# EAGLE design iso60 (EAGLE 9.6.2)
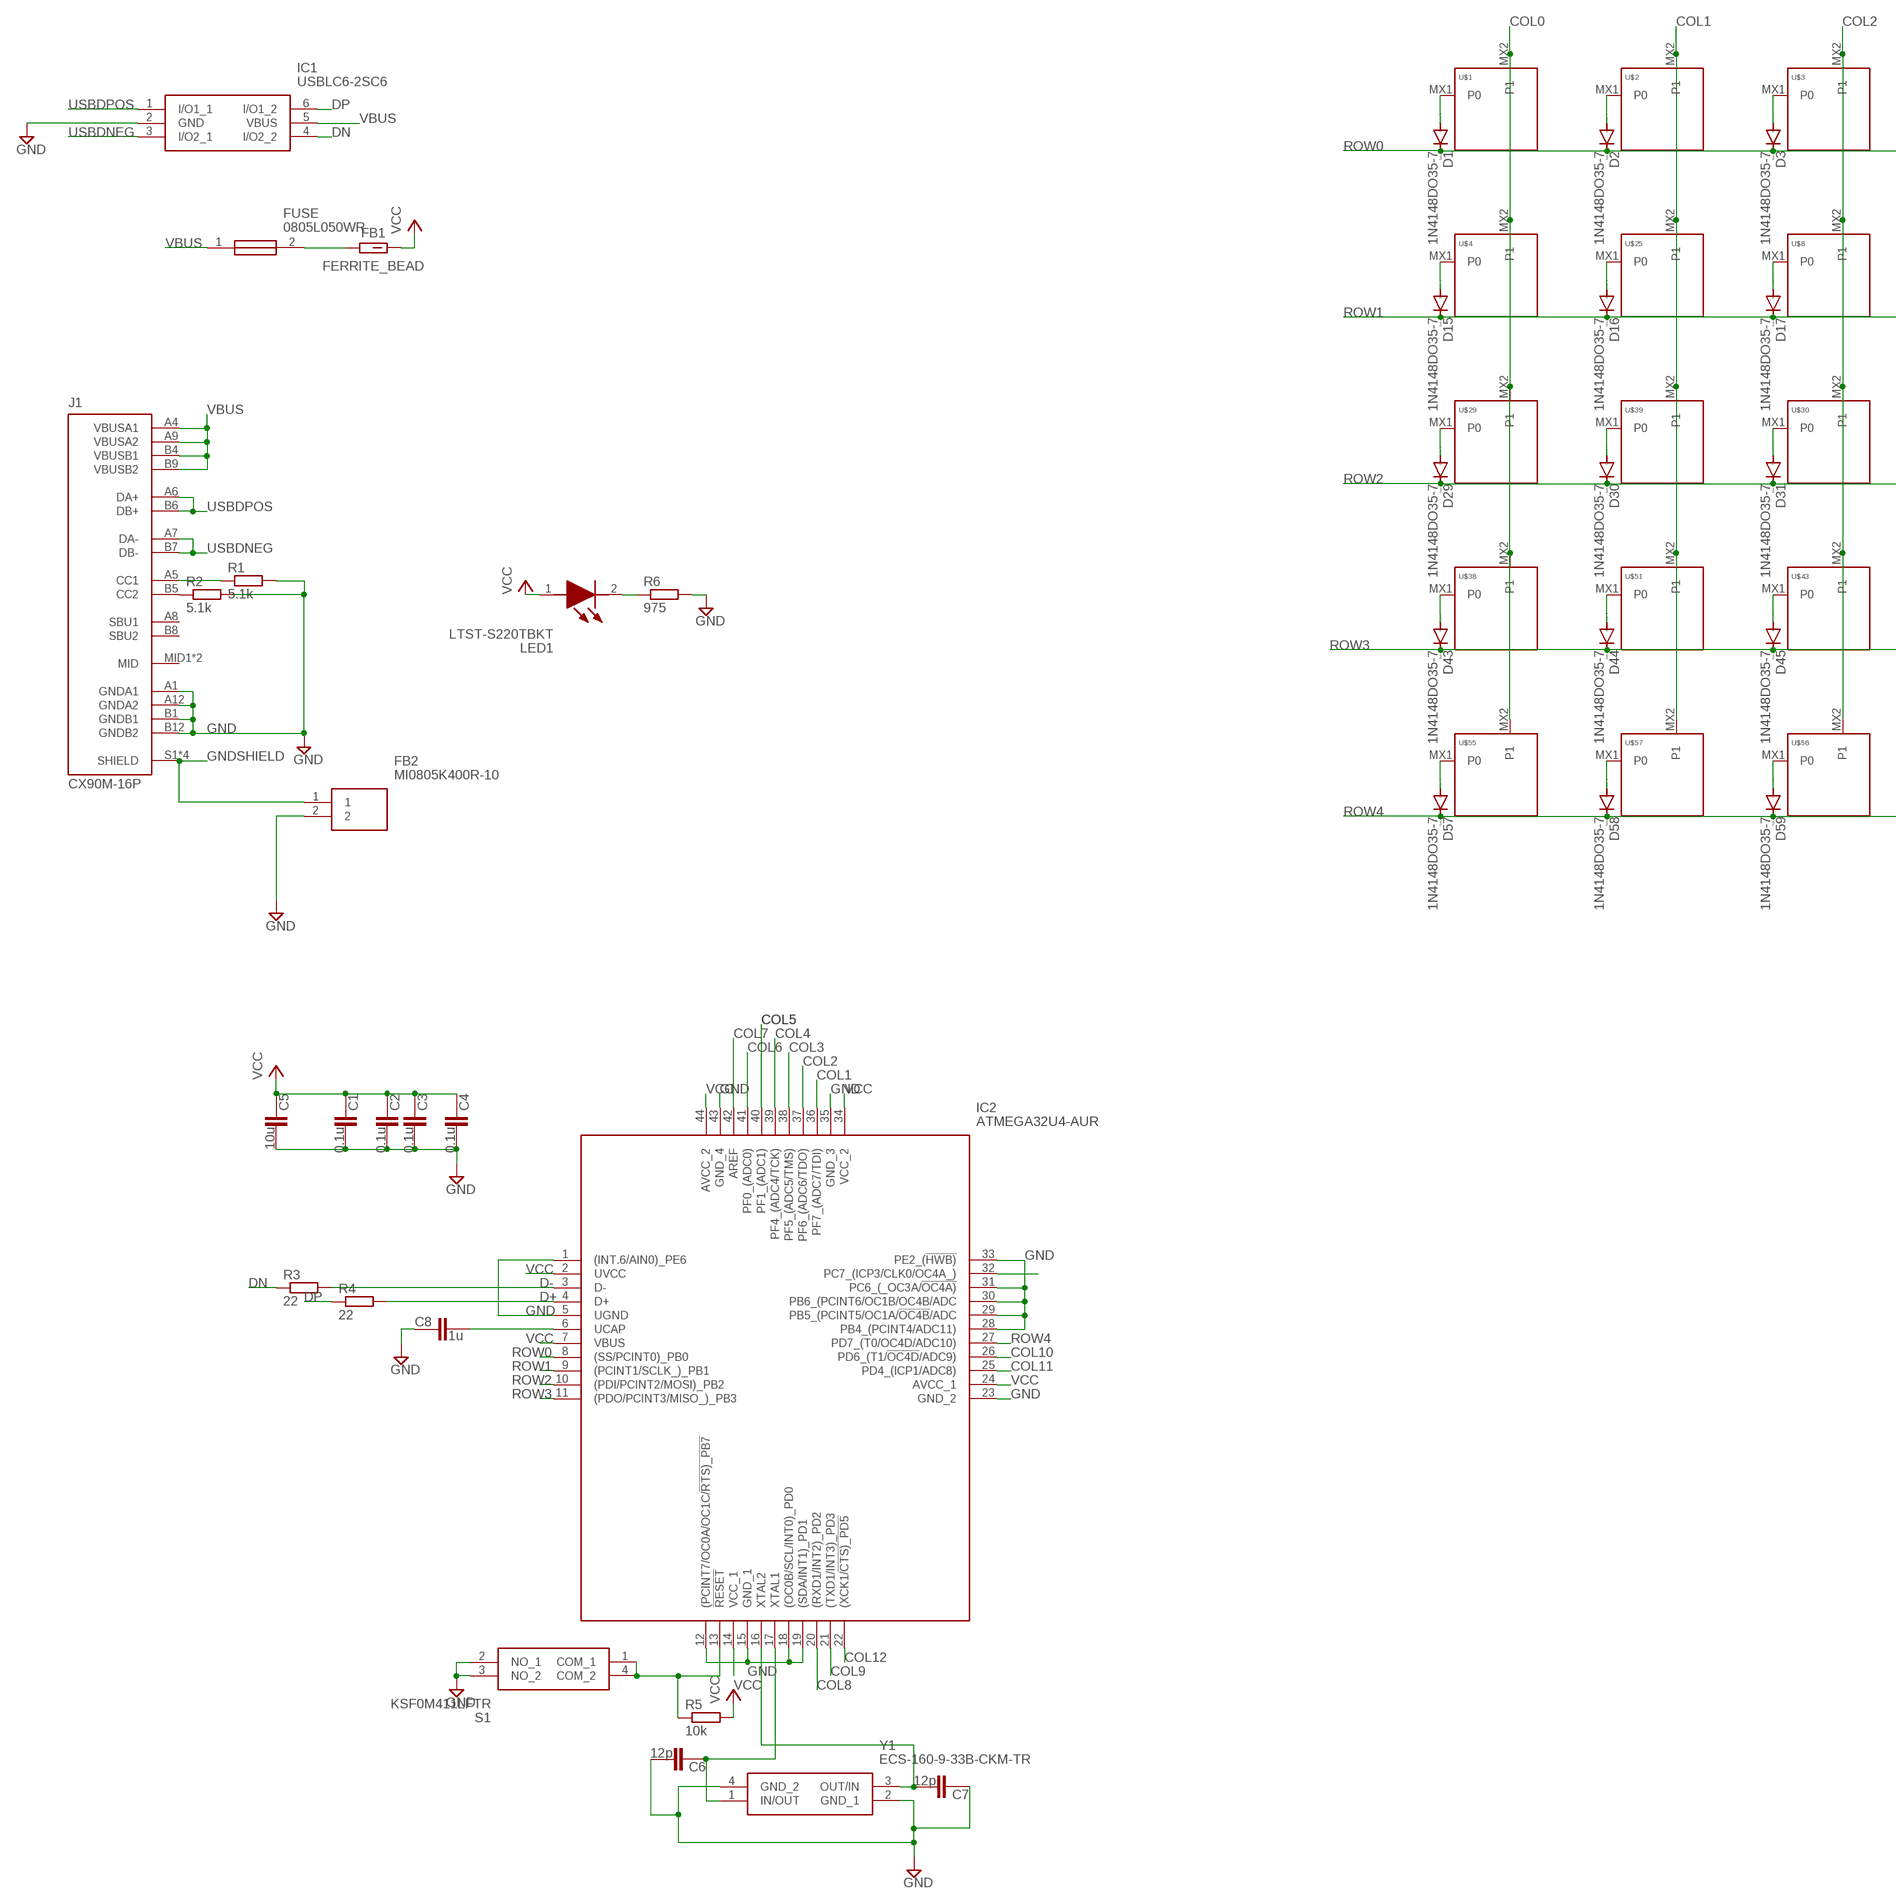
[diagram p0: schematic, sheet 1, part 1 of 2]
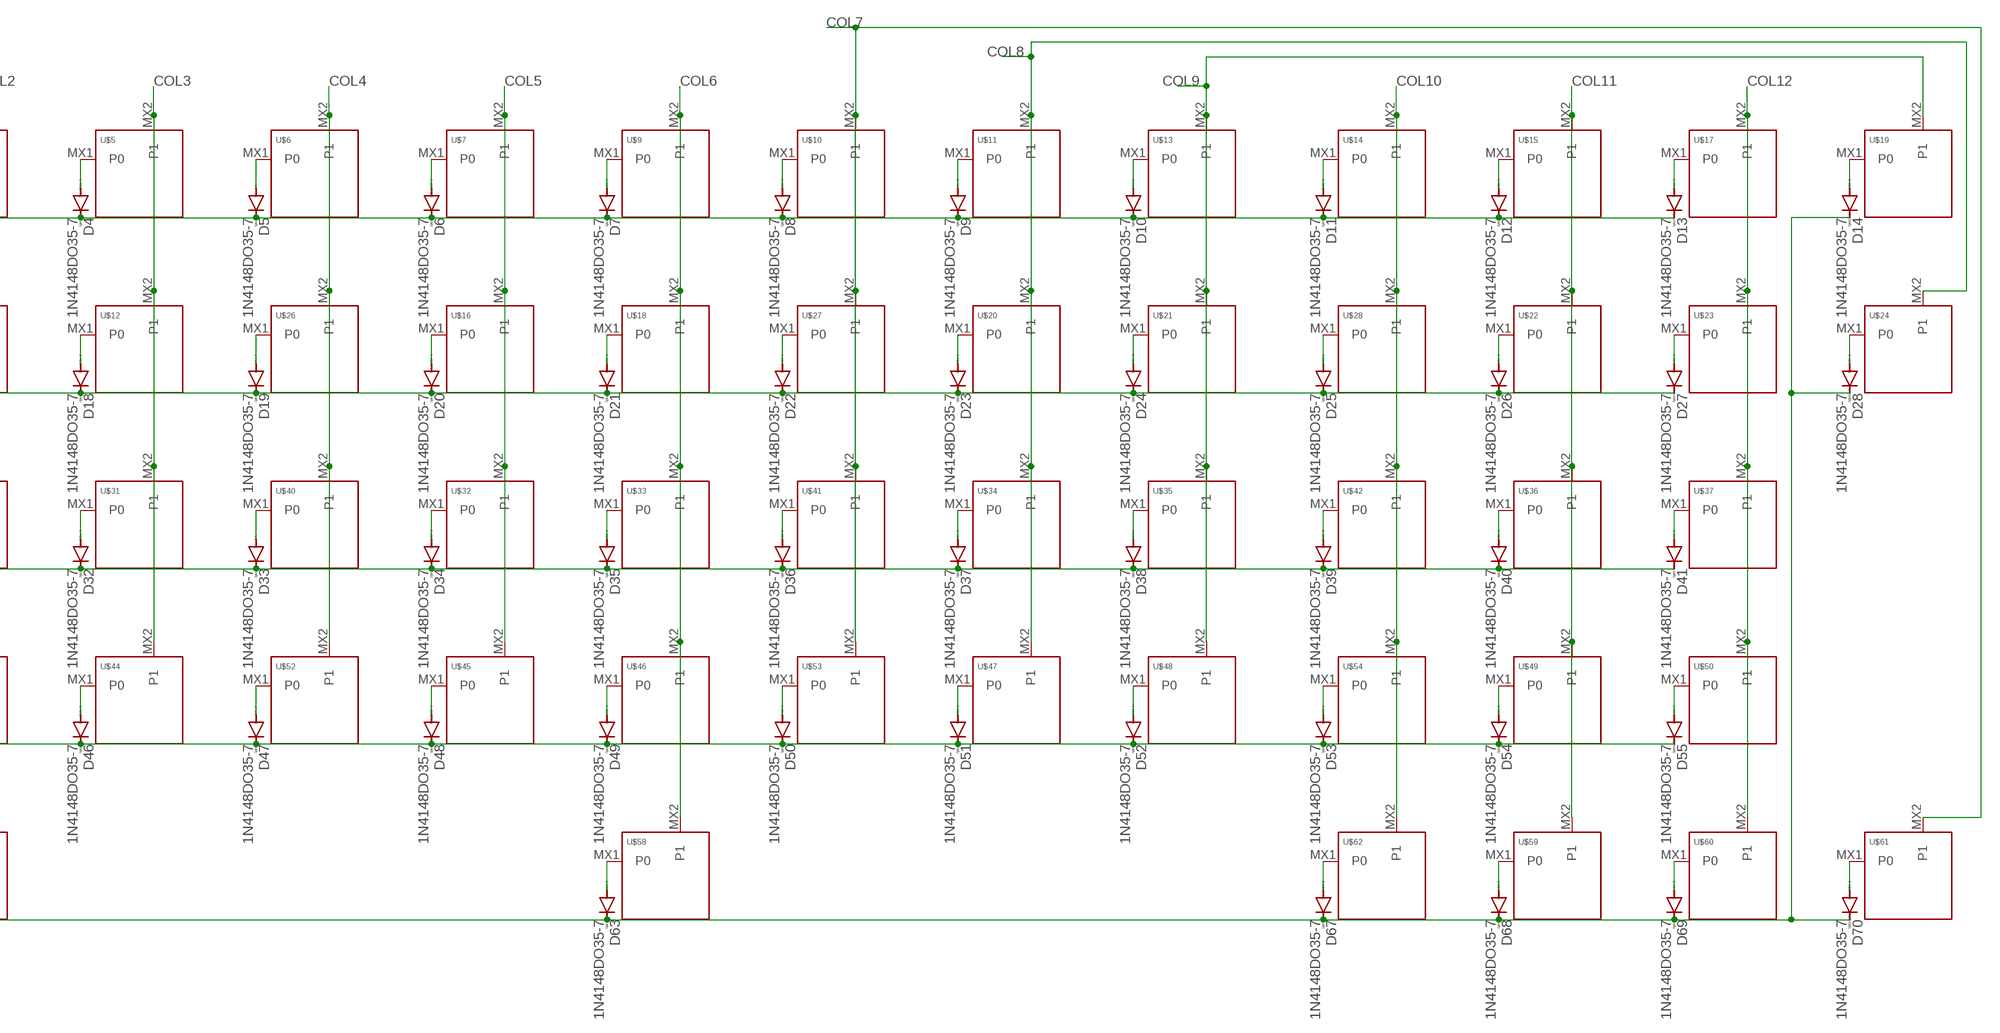
[diagram p1: schematic, sheet 1, part 2 of 2]

## Parts
C1  0.1u  CAPACITOR-C0805  [C0805]
C2  0.1u  CAPACITOR-C0805  [C0805]
C3  0.1u  CAPACITOR-C0805  [C0805]
C4  0.1u  CAPACITOR-C0805  [C0805]
C5  10u  CAPACITOR-C0805  [C0805]
C6  12p  CAPACITOR-C0805  [C0805]
C7  12p  CAPACITOR-C0805  [C0805]
C8  1u  CAPACITOR-C0805  [C0805]
D1  1N4148DO35-7  [DO35-7]
D2  1N4148DO35-7  [DO35-7]
D3  1N4148DO35-7  [DO35-7]
D4  1N4148DO35-7  [DO35-7]
D5  1N4148DO35-7  [DO35-7]
D6  1N4148DO35-7  [DO35-7]
D7  1N4148DO35-7  [DO35-7]
D8  1N4148DO35-7  [DO35-7]
D9  1N4148DO35-7  [DO35-7]
D10  1N4148DO35-7  [DO35-7]
D11  1N4148DO35-7  [DO35-7]
D12  1N4148DO35-7  [DO35-7]
D13  1N4148DO35-7  [DO35-7]
D14  1N4148DO35-7  [DO35-7]
D15  1N4148DO35-7  [DO35-7]
D16  1N4148DO35-7  [DO35-7]
D17  1N4148DO35-7  [DO35-7]
D18  1N4148DO35-7  [DO35-7]
D19  1N4148DO35-7  [DO35-7]
D20  1N4148DO35-7  [DO35-7]
D21  1N4148DO35-7  [DO35-7]
D22  1N4148DO35-7  [DO35-7]
D23  1N4148DO35-7  [DO35-7]
D24  1N4148DO35-7  [DO35-7]
D25  1N4148DO35-7  [DO35-7]
D26  1N4148DO35-7  [DO35-7]
D27  1N4148DO35-7  [DO35-7]
D28  1N4148DO35-7  [DO35-7]
D29  1N4148DO35-7  [DO35-7]
D30  1N4148DO35-7  [DO35-7]
D31  1N4148DO35-7  [DO35-7]
D32  1N4148DO35-7  [DO35-7]
D33  1N4148DO35-7  [DO35-7]
D34  1N4148DO35-7  [DO35-7]
D35  1N4148DO35-7  [DO35-7]
D36  1N4148DO35-7  [DO35-7]
D37  1N4148DO35-7  [DO35-7]
D38  1N4148DO35-7  [DO35-7]
D39  1N4148DO35-7  [DO35-7]
D40  1N4148DO35-7  [DO35-7]
D41  1N4148DO35-7  [DO35-7]
D43  1N4148DO35-7  [DO35-7]
D44  1N4148DO35-7  [DO35-7]
D45  1N4148DO35-7  [DO35-7]
D46  1N4148DO35-7  [DO35-7]
D47  1N4148DO35-7  [DO35-7]
D48  1N4148DO35-7  [DO35-7]
D49  1N4148DO35-7  [DO35-7]
D50  1N4148DO35-7  [DO35-7]
D51  1N4148DO35-7  [DO35-7]
D52  1N4148DO35-7  [DO35-7]
D53  1N4148DO35-7  [DO35-7]
D54  1N4148DO35-7  [DO35-7]
D55  1N4148DO35-7  [DO35-7]
D57  1N4148DO35-7  [DO35-7]
D58  1N4148DO35-7  [DO35-7]
D59  1N4148DO35-7  [DO35-7]
D63  1N4148DO35-7  [DO35-7]
D67  1N4148DO35-7  [DO35-7]
D68  1N4148DO35-7  [DO35-7]
D69  1N4148DO35-7  [DO35-7]
D70  1N4148DO35-7  [DO35-7]
FB1  FERRITE_BEAD  FBCHIP-0805(2012-METRIC)  [BEADC2012X105N]
FB2  MI0805K400R-10  [BEADC2012X110N]
FUSE  0805L050WR  [FUSC2114X125N]
IC1  USBLC6-2SC6  [SOT95P280X145-6N]
IC2  ATMEGA32U4-AUR  [QFP80P1200X1200X120-44N]
J1  CX90M-16P  [HRS_CX90M-16P]
LED1  LTST-S220TBKT  [LTSTS220TBKT]
R1  5.1k  RESISTOR-0805  [R0805]
R2  5.1k  RESISTOR-0805  [R0805]
R3  22  RESISTOR-0805  [R0805]
R4  22  RESISTOR-0805  [R0805]
R5  10k  RESISTOR-0805  [R0805]
R6  975  RESISTOR-0805  [R0805]
S1  KSF0M411LFTR  [KSF0M411LFTR]
U$1  KEYSWITCH-PLAIN-MXHS-1U  [MXHS-1U]
U$2  KEYSWITCH-PLAIN-MXHS-1U  [MXHS-1U]
U$3  KEYSWITCH-PLAIN-MXHS-1U  [MXHS-1U]
U$4  KEYSWITCH-PLAIN-MXHS-1U  [MXHS-1U]
U$5  KEYSWITCH-PLAIN-MXHS-1U  [MXHS-1U]
U$6  KEYSWITCH-PLAIN-MXHS-1U  [MXHS-1U]
U$7  KEYSWITCH-PLAIN-MXHS-1U  [MXHS-1U]
U$8  KEYSWITCH-PLAIN-MXHS-1U  [MXHS-1U]
U$9  KEYSWITCH-PLAIN-MXHS-1U  [MXHS-1U]
U$10  KEYSWITCH-PLAIN-MXHS-1U  [MXHS-1U]
U$11  KEYSWITCH-PLAIN-MXHS-1U  [MXHS-1U]
U$12  KEYSWITCH-PLAIN-MXHS-1U  [MXHS-1U]
U$13  KEYSWITCH-PLAIN-MXHS-1U  [MXHS-1U]
U$14  KEYSWITCH-PLAIN-MXHS-1U  [MXHS-1U]
U$15  KEYSWITCH-PLAIN-MXHS-1U  [MXHS-1U]
U$16  KEYSWITCH-PLAIN-MXHS-1U  [MXHS-1U]
U$17  KEYSWITCH-PLAIN-MXHS-1U  [MXHS-1U]
U$18  KEYSWITCH-PLAIN-MXHS-1U  [MXHS-1U]
U$19  KEYSWITCH-PLAIN-MXHS-1U  [MXHS-1U]
U$20  KEYSWITCH-PLAIN-MXHS-1U  [MXHS-1U]
U$21  KEYSWITCH-PLAIN-MXHS-1U  [MXHS-1U]
U$22  KEYSWITCH-PLAIN-MXHS-1U  [MXHS-1U]
U$23  KEYSWITCH-PLAIN-MXHS-1U  [MXHS-1U]
U$24  KEYSWITCH-PLAIN-MXHS-1U  [MXHS-1U]
U$25  KEYSWITCH-PLAIN-MXHS-1U  [MXHS-1U]
U$26  KEYSWITCH-PLAIN-MXHS-1U  [MXHS-1U]
U$27  KEYSWITCH-PLAIN-MXHS-1U  [MXHS-1U]
U$28  KEYSWITCH-PLAIN-MXHS-1U  [MXHS-1U]
U$29  KEYSWITCH-PLAIN-MXHS-1U  [MXHS-1U]
U$30  KEYSWITCH-PLAIN-MXHS-1U  [MXHS-1U]
U$31  KEYSWITCH-PLAIN-MXHS-1U  [MXHS-1U]
U$32  KEYSWITCH-PLAIN-MXHS-1U  [MXHS-1U]
U$33  KEYSWITCH-PLAIN-MXHS-1U  [MXHS-1U]
U$34  KEYSWITCH-PLAIN-MXHS-1U  [MXHS-1U]
U$35  KEYSWITCH-PLAIN-MXHS-1U  [MXHS-1U]
U$36  KEYSWITCH-PLAIN-MXHS-1U  [MXHS-1U]
U$37  KEYSWITCH-PLAIN-MXHS-1U  [MXHS-1U]
U$38  KEYSWITCH-PLAIN-MXHS-1U  [MXHS-1U]
U$39  KEYSWITCH-PLAIN-MXHS-1U  [MXHS-1U]
U$40  KEYSWITCH-PLAIN-MXHS-1U  [MXHS-1U]
U$41  KEYSWITCH-PLAIN-MXHS-1U  [MXHS-1U]
U$42  KEYSWITCH-PLAIN-MXHS-1U  [MXHS-1U]
U$43  KEYSWITCH-PLAIN-MXHS-1U  [MXHS-1U]
U$44  KEYSWITCH-PLAIN-MXHS-1U  [MXHS-1U]
U$45  KEYSWITCH-PLAIN-MXHS-1U  [MXHS-1U]
U$46  KEYSWITCH-PLAIN-MXHS-1U  [MXHS-1U]
U$47  KEYSWITCH-PLAIN-MXHS-1U  [MXHS-1U]
U$48  KEYSWITCH-PLAIN-MXHS-1U  [MXHS-1U]
U$49  KEYSWITCH-PLAIN-MXHS-1U  [MXHS-1U]
U$50  KEYSWITCH-PLAIN-MXHS-1U  [MXHS-1U]
U$51  KEYSWITCH-PLAIN-MXHS-1U  [MXHS-1U]
U$52  KEYSWITCH-PLAIN-MXHS-1U  [MXHS-1U]
U$53  KEYSWITCH-PLAIN-MXHS-1U  [MXHS-1U]
U$54  KEYSWITCH-PLAIN-MXHS-1U  [MXHS-1U]
U$55  KEYSWITCH-PLAIN-MXHS-1U  [MXHS-1U]
U$56  KEYSWITCH-PLAIN-MXHS-1U  [MXHS-1U]
U$57  KEYSWITCH-PLAIN-MXHS-1U  [MXHS-1U]
U$58  KEYSWITCH-PLAIN-MXHS-1U  [MXHS-1U]
U$59  KEYSWITCH-PLAIN-MXHS-1U  [MXHS-1U]
U$60  KEYSWITCH-PLAIN-MXHS-1U  [MXHS-1U]
U$61  KEYSWITCH-PLAIN-MXHS-1U  [MXHS-1U]
U$62  KEYSWITCH-PLAIN-MXHS-1U  [MXHS-1U]
Y1  ECS-160-9-33B-CKM-TR  [ECS2501033BCKMTR]

## Nets
COL0: IC2.32(PC7_(ICP3/CLK0/OC4A_)) U$1.MX2(P1) U$4.MX2(P1) U$29.MX2(P1) U$38.MX2(P1) U$55.MX2(P1)
COL1: IC2.36(PF7_(ADC7/TDI)) U$2.MX2(P1) U$25.MX2(P1) U$39.MX2(P1) U$51.MX2(P1) U$57.MX2(P1)
COL2: IC2.37(PF6_(ADC6/TDO)) U$3.MX2(P1) U$8.MX2(P1) U$30.MX2(P1) U$43.MX2(P1) U$56.MX2(P1)
COL3: IC2.38(PF5_(ADC5/TMS)) U$5.MX2(P1) U$12.MX2(P1) U$31.MX2(P1) U$44.MX2(P1)
COL4: IC2.39(PF4_(ADC4/TCK)) U$6.MX2(P1) U$26.MX2(P1) U$40.MX2(P1) U$52.MX2(P1)
COL5: IC2.40(PF1_(ADC1)) U$7.MX2(P1) U$16.MX2(P1) U$32.MX2(P1) U$45.MX2(P1)
COL6: IC2.41(PF0_(ADC0)) U$9.MX2(P1) U$18.MX2(P1) U$33.MX2(P1) U$46.MX2(P1) U$58.MX2(P1)
COL7: IC2.42(AREF) U$10.MX2(P1) U$27.MX2(P1) U$41.MX2(P1) U$53.MX2(P1) U$61.MX2(P1)
COL8: IC2.20((RXD1/INT2)_PD2) U$11.MX2(P1) U$20.MX2(P1) U$24.MX2(P1) U$34.MX2(P1) U$47.MX2(P1)
COL9: IC2.21((TXD1/INT3)_PD3) U$13.MX2(P1) U$19.MX2(P1) U$21.MX2(P1) U$35.MX2(P1) U$48.MX2(P1)
COL10: IC2.26(PD6_(T1/!OC4D!/ADC9)) U$14.MX2(P1) U$28.MX2(P1) U$42.MX2(P1) U$54.MX2(P1) U$62.MX2(P1)
COL11: IC2.25(PD4_(ICP1/ADC8)) U$15.MX2(P1) U$22.MX2(P1) U$36.MX2(P1) U$49.MX2(P1) U$59.MX2(P1)
COL12: IC2.22((XCK1/!CTS)_PD5) U$17.MX2(P1) U$23.MX2(P1) U$37.MX2(P1) U$50.MX2(P1) U$60.MX2(P1)
D+: IC2.4(D+) R4.2
D-: IC2.3(D-) R3.2
DN: IC1.4(I/O2_2) R3.1
DP: IC1.6(I/O1_2) R4.1
GND: C1.2 C2.2 C3.2 C4.2 C5.2 C6.2 C7.1 C8.1 FB2.2 IC1.2(GND) IC2.1((INT.6/AIN0)_PE6) IC2.5(UGND) IC2.12((PCINT7/OC0A/OC1C/!RTS)_PB7) IC2.15(GND_1) IC2.18((OC0B/SCL/INT0)_PD0) IC2.19((SDA/INT1)_PD1) IC2.23(GND_2) IC2.28(PB4_(PCINT4/ADC11)) IC2.29(PB5_(PCINT5/OC1A/!OC4B!/ADC) IC2.30(PB6_(PCINT6/OC1B/OC4B/ADC) IC2.31(PC6_(_OC3A/!OC4A)) IC2.33(PE2_(!HWB)) IC2.35(GND_3) IC2.43(GND_4) J1.A1(GNDA1) J1.A12(GNDA2) J1.B1(GNDB1) J1.B12(GNDB2) R1.2 R2.2 R6.2 S1.2(NO_1) S1.3(NO_2) Y1.2(GND_1) Y1.4(GND_2)
GNDSHIELD: FB2.1 J1.S1(SHIELD) J1.S2(SHIELD) J1.S3(SHIELD) J1.S4(SHIELD)
N$1: D1.A U$1.MX1(P0)
N$2: D2.A U$2.MX1(P0)
N$3: D3.A U$3.MX1(P0)
N$4: D4.A U$5.MX1(P0)
N$5: D5.A U$6.MX1(P0)
N$6: D6.A U$7.MX1(P0)
N$7: D7.A U$9.MX1(P0)
N$8: D8.A U$10.MX1(P0)
N$9: D9.A U$11.MX1(P0)
N$10: D10.A U$13.MX1(P0)
N$11: D11.A U$14.MX1(P0)
N$12: D12.A U$15.MX1(P0)
N$13: D13.A U$17.MX1(P0)
N$14: D14.A U$19.MX1(P0)
N$15: D15.A U$4.MX1(P0)
N$16: D16.A U$25.MX1(P0)
N$17: D17.A U$8.MX1(P0)
N$18: D18.A U$12.MX1(P0)
N$19: D19.A U$26.MX1(P0)
N$20: D20.A U$16.MX1(P0)
N$21: D21.A U$18.MX1(P0)
N$22: D22.A U$27.MX1(P0)
N$23: D23.A U$20.MX1(P0)
N$24: D24.A U$21.MX1(P0)
N$25: D25.A U$28.MX1(P0)
N$26: D26.A U$22.MX1(P0)
N$27: D27.A U$23.MX1(P0)
N$28: D28.A U$24.MX1(P0)
N$29: D29.A U$29.MX1(P0)
N$30: D30.A U$39.MX1(P0)
N$31: D31.A U$30.MX1(P0)
N$32: D32.A U$31.MX1(P0)
N$33: D33.A U$40.MX1(P0)
N$34: D34.A U$32.MX1(P0)
N$35: D35.A U$33.MX1(P0)
N$36: D36.A U$41.MX1(P0)
N$37: D37.A U$34.MX1(P0)
N$38: D38.A U$35.MX1(P0)
N$39: D39.A U$42.MX1(P0)
N$40: D40.A U$36.MX1(P0)
N$41: D41.A U$37.MX1(P0)
N$42: D43.A U$38.MX1(P0)
N$43: D44.A U$51.MX1(P0)
N$44: D45.A U$43.MX1(P0)
N$45: D46.A U$44.MX1(P0)
N$46: D47.A U$52.MX1(P0)
N$47: D48.A U$45.MX1(P0)
N$48: D49.A U$46.MX1(P0)
N$49: D50.A U$53.MX1(P0)
N$50: D51.A U$47.MX1(P0)
N$51: D52.A U$48.MX1(P0)
N$52: D53.A U$54.MX1(P0)
N$53: D54.A U$49.MX1(P0)
N$54: D55.A U$50.MX1(P0)
N$55: D57.A U$55.MX1(P0)
N$56: D58.A U$57.MX1(P0)
N$57: D59.A U$56.MX1(P0)
N$58: D63.A U$58.MX1(P0)
N$59: D67.A U$62.MX1(P0)
N$60: D68.A U$59.MX1(P0)
N$61: D69.A U$60.MX1(P0)
N$62: D70.A U$61.MX1(P0)
N$63: LED1.2(K) R6.1
N$70: J1.A5(CC1) R1.1
N$71: J1.B5(CC2) R2.1
N$72: FB1.1 FUSE.2
N$84: C6.1 IC2.17(XTAL1) Y1.1(IN/OUT)
N$85: C7.2 IC2.16(XTAL2) Y1.3(OUT/IN)
N$86: C8.2 IC2.6(UCAP)
N$88: IC2.13(!RESET) R5.1 S1.1(COM_1) S1.4(COM_2)
ROW0: D1.C D2.C D3.C D4.C D5.C D6.C D7.C D8.C D9.C D10.C D11.C D12.C D13.C IC2.8((SS/PCINT0)_PB0)
ROW1: D15.C D16.C D17.C D18.C D19.C D20.C D21.C D22.C D23.C D24.C D25.C D26.C D27.C IC2.9((PCINT1/SCLK_)_PB1)
ROW2: D29.C D30.C D31.C D32.C D33.C D34.C D35.C D36.C D37.C D38.C D39.C D40.C D41.C IC2.10((PDI/PCINT2/MOSI)_PB2)
ROW3: D43.C D44.C D45.C D46.C D47.C D48.C D49.C D50.C D51.C D52.C D53.C D54.C D55.C IC2.11((PDO/PCINT3/MISO_)_PB3)
ROW4: D14.C D28.C D57.C D58.C D59.C D63.C D67.C D68.C D69.C D70.C IC2.27(PD7_(T0/OC4D/ADC10))
USBDNEG: IC1.3(I/O2_1) J1.A7(DA-) J1.B7(DB-)
USBDPOS: IC1.1(I/O1_1) J1.A6(DA+) J1.B6(DB+)
VBUS: FUSE.1 IC1.5(VBUS) J1.A4(VBUSA1) J1.A9(VBUSA2) J1.B4(VBUSB1) J1.B9(VBUSB2)
VCC: C1.1 C2.1 C3.1 C4.1 C5.1 FB1.2 IC2.2(UVCC) IC2.7(VBUS) IC2.14(VCC_1) IC2.24(AVCC_1) IC2.34(VCC_2) IC2.44(AVCC_2) LED1.1(A) R5.2
Unconnected: J1.A8(SBU1) J1.B8(SBU2) J1.MID1(MID) J1.MID2(MID)

## Library data of the parts
C1-C8 = Components:CAPACITOR
D1-D41 D43-D55 D57-D59 D63 D67-D70 = diode:1N4148: DIODE high speed (Philips)
FB1 = Filter:FB: Ferrite Bead - Generic; CATEGORY: Filter; SUB-CATEGORY: Ferrite
FB2 = SamacSys_Parts:MI0805K400R-10: EMI Ferrite Chip Bead EMI Ferrite Chip Bead Source: Datasheet; DESCRIPTION: EMI Ferrite Chip Bead EMI Ferrite Chip Bead; HEIGHT: 1.1mm; MANUFACTURER_NAME: Laird Technologies; MANUFACTURER_PART_NUMBER: MI0805K400R-10; MOUSER_PART_NUMBER: N/A; MOUSER_PRICE-STOCK: https://www.mouser.co.uk/ProductDetail/Laird/MI0805K400R-10/?qs=PzGy0jfpSMtYiKtvyx%2FtrQ%3D%3D
FUSE = SamacSys_Parts:0805L050WR: LITTELFUSE - 0805L050WR - RESETTABLE FUSE, 0805, 6V, 0.5A Source: Datasheet <http://www.littelfuse.com/~/media/electronics/datasheets/resettable_ptcs/littelfuse_ptc_0805l_datasheet.pdf.pdf>; DESCRIPTION: LITTELFUSE - 0805L050WR - RESETTABLE FUSE, 0805, 6V, 0.5A; HEIGHT: 1.25mm; MANUFACTURER_NAME: LITTELFUSE; MANUFACTURER_PART_NUMBER: 0805L050WR; MOUSER_PART_NUMBER: 576-0805L050; MOUSER_PRICE-STOCK: https://www.mouser.co.uk/ProductDetail/Littelfuse/0805L050WR?qs=SJZ%252BTX%252BI2BS1ufZ22HRodg%3D%3D
IC1 = SamacSys_Parts:USBLC6-2SC6: TVS Diode Array Uni-Directional USBLC6-2SC6 17V, SOT-23 6-Pin Source: Datasheet <http://www.st.com/st-web-ui/static/active/en/resource/technical/document/datasheet/CD00050750.pdf>; DESCRIPTION: TVS Diode Array Uni-Directional USBLC6-2SC6 17V, SOT-23 6-Pin; HEIGHT: 1.45mm; MANUFACTURER_NAME: STMicroelectronics; MANUFACTURER_PART_NUMBER: USBLC6-2SC6; MOUSER_PART_NUMBER: 511-USBLC6-2SC6; MOUSER_PRICE-STOCK: https://www.mouser.co.uk/ProductDetail/STMicroelectronics/USBLC6-2SC6/?qs=po45yt2pPpu%2FhNIlwQdTlg%3D%3D
IC2 = SamacSys_Parts:ATMEGA32U4-AUR: 8-bit Microcontrollers - MCU USB 32K Flash 16 MHz Source: Datasheet; DESCRIPTION: 8-bit Microcontrollers - MCU USB 32K Flash 16 MHz; HEIGHT: 1.2mm; MANUFACTURER_NAME: Microchip; MANUFACTURER_PART_NUMBER: ATMEGA32U4-AUR; MOUSER_PART_NUMBER: 556-ATMEGA32U4-AUR; MOUSER_PRICE-STOCK: https://www.mouser.co.uk/ProductDetail/Microchip-Technology-Atmel/ATMEGA32U4-AUR?qs=rBGENRD8NwIbVIAimLns%252BA%3D%3D
J1 = CX90M-16P:CX90M-16P: USB-C (USB TYPE-C) USB 3.1 (USB 3.1 Gen 2, Superspeed+) Receptacle Connector 24 (16+8 Dummy) Position Board Edge, Cutout; Surface Mount; Through Hole, Right Angle Check prices <https://pricing.snapeda.com/parts/CX90M-16P/Hirose%20Electric%20Co%20Ltd/view-part?ref=eda>; AVAILABILITY: Warning; DESCRIPTION: USB-C (USB TYPE-C) USB 3.2 Gen 2 (USB 3.1 Gen 2, Superspeed + (USB 3.1)) Receptacle Connector 24 (16+8 Dummy) Position Board Edge, Cutout; Surface Mount; Through Hole, Right Angle; MF: Hirose Electric Co Ltd; MP: CX90M-16P; PACKAGE: None; PRICE: None; PURCHASE-URL: https://pricing.snapeda.com/search/part/CX90M-16P/?ref=eda
LED1 = SamacSys_Parts:LTST-S220TBKT: LED,0805,Side View,Blue,30mcd Lite-On LTST-S220TBKT Blue LED, 475 nm 2012 (0805) Side View, Rectangle Lens SMD package Source: Datasheet <http://optoelectronics.liteon.com/upload/download/DS22-2000-239/LTST-S220TBKT.pdf>; DESCRIPTION: LED,0805,Side View,Blue,30mcd Lite-On LTST-S220TBKT Blue LED, 475 nm 2012 (0805) Side View, Rectangle Lens SMD package; HEIGHT: 1.1mm; MANUFACTURER_NAME: Lite-On; MANUFACTURER_PART_NUMBER: LTST-S220TBKT; MOUSER_PART_NUMBER: 859-LTST-S220TBKT; MOUSER_PRICE-STOCK: https://www.mouser.co.uk/ProductDetail/Lite-On/LTST-S220TBKT/?qs=6X4AWLaL1XJ9Adu1iuzfWw%3D%3D
R1-R6 = Components:RESISTOR
S1 = SamacSys_Parts:KSF0M411LFTR: Tactile Switches NO SPST Flat Bttn PC 0.05A 32VDC 1W Source: Datasheet <https://www.mouser.de/datasheet/2/60/ksf-1841280.pdf>; DESCRIPTION: Tactile Switches NO SPST Flat Bttn PC 0.05A 32VDC 1W; HEIGHT: 2.6mm; MANUFACTURER_NAME: C & K COMPONENTS; MANUFACTURER_PART_NUMBER: KSF0M411LFTR; MOUSER_PART_NUMBER: 611-KSF0M411LFT; MOUSER_PRICE-STOCK: https://www.mouser.com/Search/Refine.aspx?Keyword=611-KSF0M411LFT
U$1-U$62 = Keyboard:KEYSWITCH-PLAIN
Y1 = SamacSys_Parts:ECS-160-9-33B-CKM-TR: Crystals 16MHz 9pF 10ppm -20C +70C Source: Datasheet <https://www.ecsxtal.com/store/pdf/ECS-33B.pdf>; DESCRIPTION: Crystals 16MHz 9pF 10ppm -20C +70C; HEIGHT: 0.8mm; MANUFACTURER_NAME: ECS; MANUFACTURER_PART_NUMBER: ECS-160-9-33B-CKM-TR; MOUSER_PART_NUMBER: 520-160-9-33B-CKMT; MOUSER_PRICE-STOCK: https://www.mouser.co.uk/ProductDetail/ECS/ECS-160-9-33B-CKM-TR?qs=w%2Fv1CP2dgqoeVW%2FkD0CR0g%3D%3D

## Board
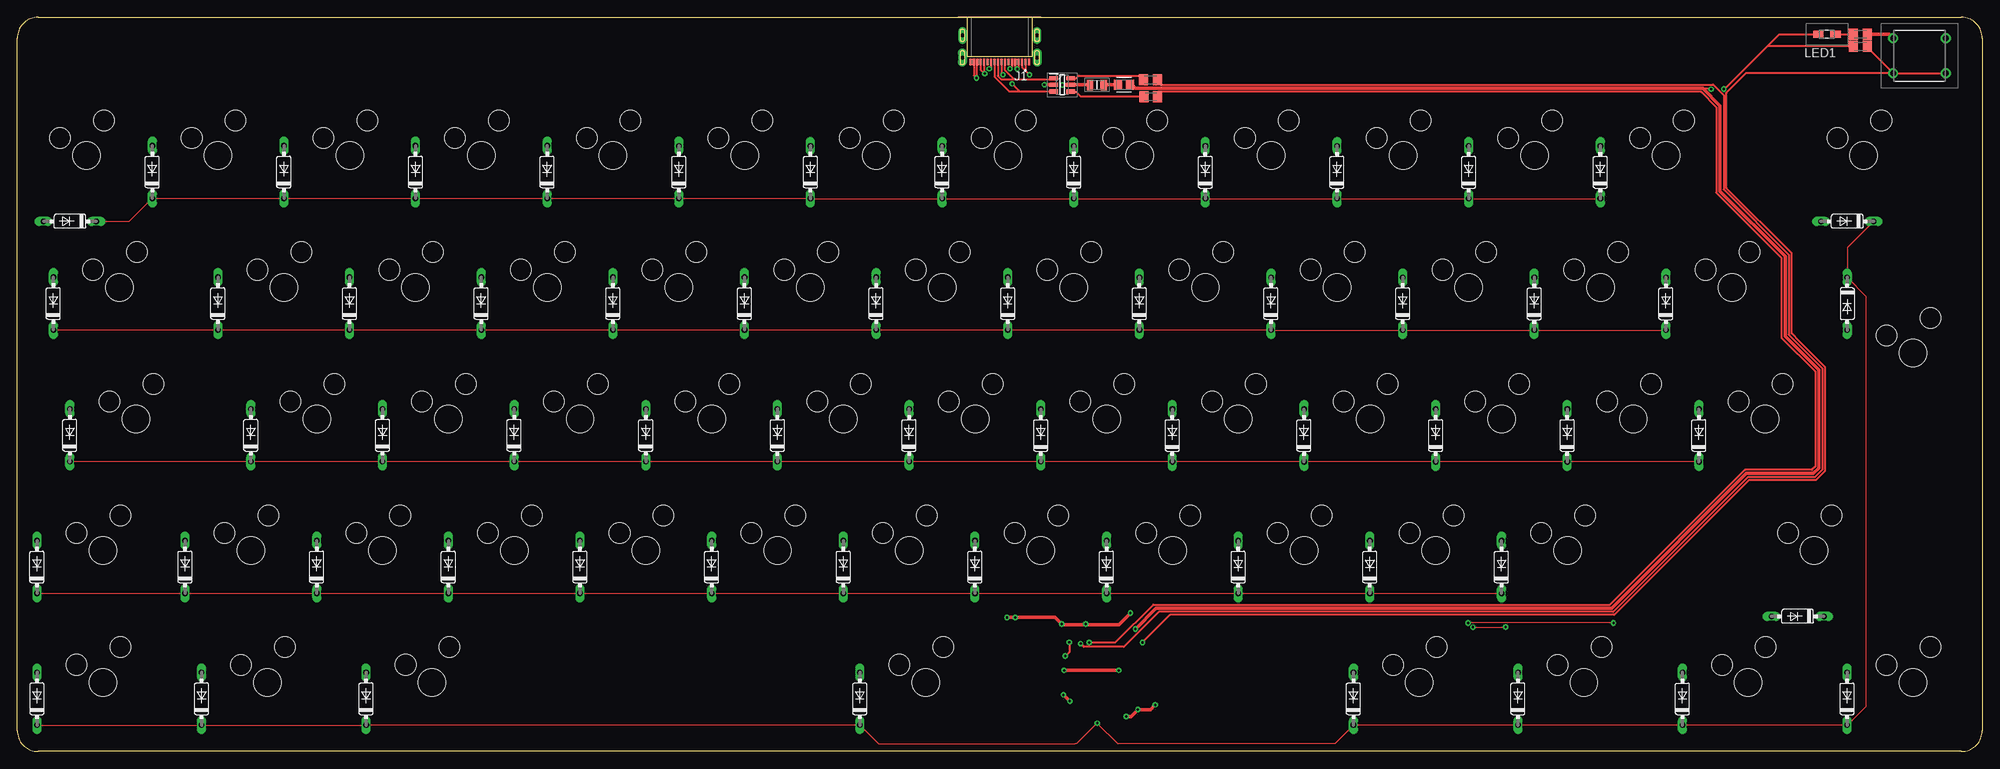
[diagram p2: board, top side]
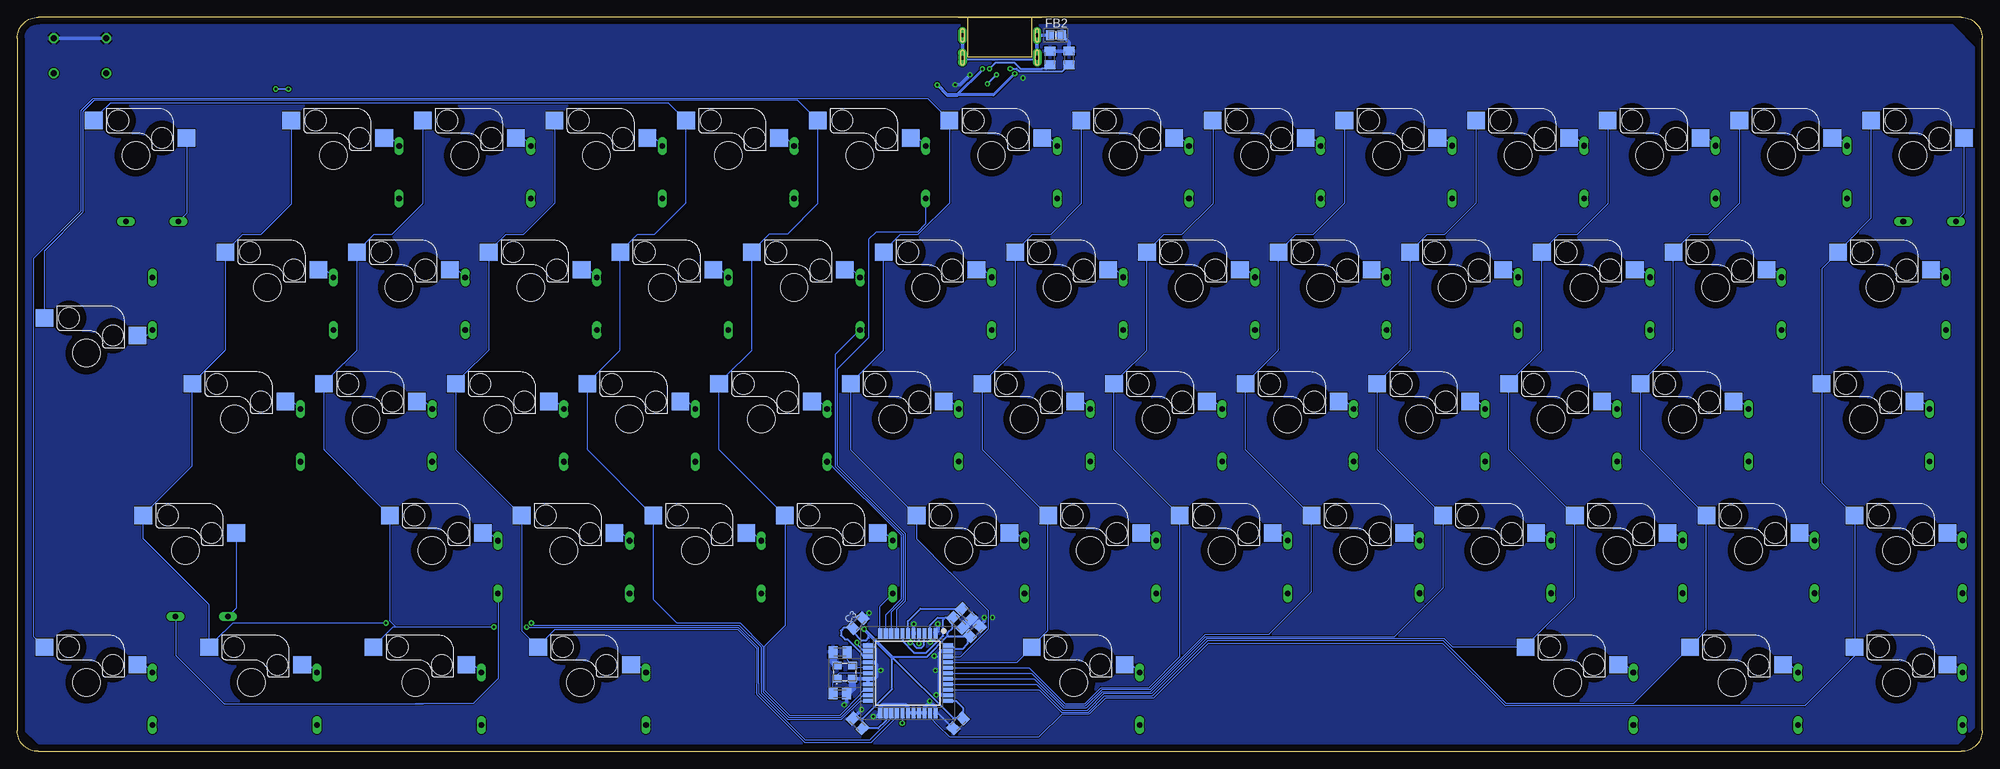
[diagram p3: board, bottom side, seen from below]

Size 284.32 x 106.2 mm. Coordinates in mm from the lower left corner, seen from the top.
Outline: 281.32,0 3,0 arc-90 0,3 0,103.2 arc-90 3,106.2 281.32,106.2 arc-90 284.32,103.2 284.32,3 arc-90 281.32,0
Copper layers (1*16): Top 0.035mm / dielectric 1.5mm / Bottom 0.035mm
Design rules "default": minimum track width 6mil, minimum drill 0.35mm, track to track 6mil, track to pad 6mil, pad to pad 6mil, via to via 6mil, smd to smd 6mil, copper to edge 40mil, drill to drill 6mil, minimum pad ring 10mil, minimum via ring 8mil, stop-mask expansion 4mil, vias tented up to drill 0mil, thermal gap 10mil

### Footprints (pad centres in the part's own frame; a part is rotated, then mirrored left to right if it is on the bottom)
C0805 = smd 1.3 x 1.6: 1 -1,0; 2 1,0
DO35-7 = drill 0.813 long: A 3.81,0; C -3.81,0
BEADC2012X105N = smd 1.165 x 1.465: 1 -0.875,0; 2 0.875,0
BEADC2012X110N = smd 1.2 x 1.45: 1 -0.85,0; 2 0.85,0
FUSC2114X125N = smd 0.93 x 1.52: 1 -1,0; 2 1,0
SOT95P280X145-6N = smd 1.2 x 0.6: 1 -1.25,0.95; 2 -1.25,0; 3 -1.25,-0.95; 4 1.25,-0.95; 5 1.25,0; 6 1.25,0.95
QFP80P1200X1200X120-44N = smd 1.5 x 0.6: 1 -5.75,4; 2 -5.75,3.2; 3 -5.75,2.4; 4 -5.75,1.6; 5 -5.75,0.8; 6 -5.75,0; 7 -5.75,-0.8; 8 -5.75,-1.6; 9 -5.75,-2.4; 10 -5.75,-3.2; 11 -5.75,-4; 23 5.75,-4; 24 5.75,-3.2; 25 5.75,-2.4; 26 5.75,-1.6; 27 5.75,-0.8; 28 5.75,0; 29 5.75,0.8; 30 5.75,1.6; 31 5.75,2.4; 32 5.75,3.2; 33 5.75,4 | smd 0.6 x 1.5: 12 -4,-5.75; 13 -3.2,-5.75; 14 -2.4,-5.75; 15 -1.6,-5.75; 16 -0.8,-5.75; 17 0,-5.75; 18 0.8,-5.75; 19 1.6,-5.75; 20 2.4,-5.75; 21 3.2,-5.75; 22 4,-5.75; 34 4,5.75; 35 3.2,5.75; 36 2.4,5.75; 37 1.6,5.75; 38 0.8,5.75; 39 0,5.75; 40 -0.8,5.75; 41 -1.6,5.75; 42 -2.4,5.75; 43 -3.2,5.75; 44 -4,5.75
HRS_CX90M-16P = smd 0.3 x 0.9: A1 -3.75,3.85; A4 -2.75,3.85; A5 -1.75,3.85; A6 -0.75,3.85; A7 0.75,3.85; A8 1.75,3.85; A9 2.75,3.85; A12 3.75,3.85; B1 3.25,3.85; B4 2.25,3.85; B5 1.25,3.85; B6 0.25,3.85; B7 -0.25,3.85; B8 -1.25,3.85; B9 -2.25,3.85; B12 -3.25,3.85; MID1 -4.25,3.85; MID2 4.25,3.85 | drill 0.55 pad 1.3 long: S1 -5.4,3.23; S2 5.4,3.23 | drill 0.55 pad 1.225 long: S3 -5.4,0; S4 5.4,0
LTSTS220TBKT = smd 1 x 1.5: 1 0,1.25; 2 0,-1.25
R0805 = smd 1.3 x 1.6: 1 -1,0; 2 1,0
KSF0M411LFTR = drill 0.9 pad 1.4: 1 0,0; 2 5.08,0; 3 5.08,7.62; 4 0,7.62
MXHS-1U = smd 2.55 x 2.5: MX1 7.36,2.54; MX2 -6.09,5.08 | hole 4: 0,0 | hole 3: 3.81,2.54; -2.54,5.08
ECS2501033BCKMTR = smd 1.3 x 1.1: 1 -1.15,-0.95; 2 1.15,-0.95; 3 1.15,0.95; 4 -1.15,0.95

### Placement (x,y rotation side)
C1  145.77,17.39 45 bottom
C2  148.19,4.06 225 bottom
C3  162.7,18.57 45 bottom
C4  162.73,4.05 135 bottom
C5  148.22,18.64 315 bottom
C6  165.29,8.34 0 bottom
C7  165.27,14.38 0 bottom
C8  146.97,19.91 135 bottom
D1  7.62,76.68 180 top
D2  19.54,83.81 90 top
D3  38.58,83.8 90 top
D4  57.63,83.8 90 top
D5  76.68,83.8 90 top
D6  95.73,83.8 90 top
D7  114.78,83.8 90 top
D8  133.82,83.79 90 top
D9  152.87,83.79 90 top
D10  171.92,83.79 90 top
D11  190.97,83.79 90 top
D12  210.02,83.78 90 top
D13  229.06,83.78 90 top
D14  264.79,76.68 180 top
D15  5.22,64.79 90 top
D16  29.04,64.79 90 top
D17  48.08,64.78 90 top
D18  67.13,64.78 90 top
D19  86.18,64.78 90 top
D20  105.23,64.78 90 top
D21  124.28,64.78 90 top
D22  143.32,64.78 90 top
D23  162.37,64.77 90 top
D24  181.42,64.77 90 top
D25  200.47,64.77 90 top
D26  219.52,64.77 90 top
D27  238.56,64.77 90 top
D28  264.77,64.76 270 top
D29  7.62,45.74 90 top
D30  33.81,45.73 90 top
D31  52.86,45.73 90 top
D32  71.9,45.73 90 top
D33  90.95,45.73 90 top
D34  110,45.73 90 top
D35  129.05,45.72 90 top
D36  148.1,45.72 90 top
D37  167.14,45.72 90 top
D38  186.19,45.72 90 top
D39  205.24,45.72 90 top
D40  224.29,45.72 90 top
D41  243.34,45.71 90 top
D43  2.85,26.69 90 top
D44  24.28,26.69 90 top
D45  43.33,26.69 90 top
D46  62.38,26.68 90 top
D47  81.43,26.68 90 top
D48  100.48,26.68 90 top
D49  119.52,26.68 90 top
D50  138.57,26.68 90 top
D51  157.62,26.68 90 top
D52  176.67,26.67 90 top
D53  195.72,26.67 90 top
D54  214.76,26.67 90 top
D55  257.62,19.52 180 top
D57  2.86,7.62 90 top
D58  26.67,7.61 90 top
D59  50.47,7.61 90 top
D63  121.91,7.61 90 top
D67  193.34,7.61 90 top
D68  217.15,7.61 90 top
D69  240.96,7.61 90 top
D70  264.77,7.61 90 top
FB1  160.15,96.43 0 top
FB2  134.04,103.61 0 bottom
FUSE  156.22,96.43 0 top
IC1  151.2,96.42 0 top
IC2  155.45,11.32 270 bottom
J1  142.15,103.59 180 top
LED1  261.84,103.74 90 top
R1  134.91,100.31 90 bottom
R2  132.15,100.32 90 bottom
R3  164.01,94.72 0 top
R4  163.99,97.14 0 top
R5  266.67,101.98 180 top
R6  266.66,103.75 0 top
S1  279.05,98.09 90 top
U$1  10,86.2 0 bottom
U$2  29.05,86.2 0 bottom
U$3  48.1,86.2 0 bottom
U$4  14.76,67.14 0 bottom
U$5  67.15,86.2 0 bottom
U$6  86.2,86.2 0 bottom
U$7  105.25,86.2 0 bottom
U$8  57.62,67.14 0 bottom
U$9  124.3,86.2 0 bottom
U$10  143.35,86.2 0 bottom
U$11  162.4,86.2 0 bottom
U$12  76.67,67.14 0 bottom
U$13  181.45,86.2 0 bottom
U$14  200.5,86.2 0 bottom
U$15  219.55,86.2 0 bottom
U$16  114.77,67.14 0 bottom
U$17  238.6,86.2 0 bottom
U$18  133.82,67.14 0 bottom
U$19  267.17,86.2 0 bottom
U$20  171.92,67.14 0 bottom
U$21  190.97,67.14 0 bottom
U$22  229.07,67.14 0 bottom
U$23  248.12,67.14 0 bottom
U$24  274.29,57.61 0 bottom
U$25  38.57,67.14 0 bottom
U$26  95.72,67.14 0 bottom
U$27  152.87,67.14 0 bottom
U$28  210.02,67.14 0 bottom
U$29  17.14,48.09 0 bottom
U$30  62.39,48.09 0 bottom
U$31  81.44,48.09 0 bottom
U$32  119.54,48.09 0 bottom
U$33  138.59,48.09 0 bottom
U$34  176.69,48.09 0 bottom
U$35  195.74,48.09 0 bottom
U$36  233.84,48.09 0 bottom
U$37  252.89,48.09 0 bottom
U$38  12.38,29.04 0 bottom
U$39  43.34,48.09 0 bottom
U$40  100.49,48.09 0 bottom
U$41  157.64,48.09 0 bottom
U$42  214.79,48.09 0 bottom
U$43  52.86,29.04 0 bottom
U$44  71.91,29.04 0 bottom
U$45  110.01,29.04 0 bottom
U$46  129.06,29.04 0 bottom
U$47  167.16,29.04 0 bottom
U$48  186.21,29.04 0 bottom
U$49  224.31,29.04 0 bottom
U$50  260,29.04 0 bottom
U$51  33.81,29.04 0 bottom
U$52  90.96,29.04 0 bottom
U$53  148.11,29.04 0 bottom
U$54  205.26,29.04 0 bottom
U$55  12.38,10 0 bottom
U$56  60,10 0 bottom
U$57  36.19,9.99 0 bottom
U$58  131.43,10 0 bottom
U$59  226.67,9.99 0 bottom
U$60  250.46,9.99 0 bottom
U$61  274.3,9.99 0 bottom
U$62  202.86,9.99 0 bottom
Y1  164.58,11.48 0 bottom

### Tracks (layer width: path | path; a pad name or v marks a point on that pad's centre or on a via)
COL0
  Bottom 0.152: U$1.MX2 16.09,77.1 19.89,73.29 19.89,73.18 U$4.MX2 23.23,69.84 U$29.MX2 23.23,38.88 U$38.MX2 U$55.MX2 18.47,13.81 25.7,6.59 69,6.59 78.09,15.68 100.86,15.68 | 100.84,15.67 100.86,15.68 | 100.86,15.68 111.99,15.68 119.95,7.72 126.89,7.72 129.23,5.38 133.18,5.38 136.47,2.1 149.41,2.1 151.06,3.74 152.25,4.94 IC2.32
COL1
  Bottom 0.152: U$2.MX2 35.14,79.3 39.63,74.81 42.19,74.81 43.71,73.29 43.71,73.18 U$25.MX2 44.66,58.05 48.47,54.25 48.47,54.13 U$39.MX2 49.43,43.65 U$51.MX2 39.9,17.57 41.32,16.15 41.32,16.03 U$57.MX2 50.46,6.89 68.85,6.89 77.95,15.99 112.11,15.99 120.08,8.02 127.02,8.02 129.36,5.68 133.22,5.68 136.45,8.92 IC2.36
COL2
  Bottom 0.152: U$3.MX2 54.19,79.23 58.61,74.81 61.24,74.81 62.76,73.29 62.76,73.18 U$8.MX2 63.71,58.05 67.52,54.25 67.52,54.13 U$30.MX2 68.48,43.65 U$43.MX2 58.95,22.33 65.14,16.15 65.14,16.03 U$56.MX2 76.6,15.08 77.81,16.29 112.24,16.29 120.2,8.33 127.14,8.33 129.48,5.99 133.09,5.99 136.82,9.72 IC2.37
COL3
  Bottom 0.152: U$5.MX2 73.24,79.32 77.74,74.81 80.29,74.81 81.81,73.29 81.81,73.18 U$12.MX2 82.76,58.05 86.57,54.25 86.57,54.13 U$31.MX2 87.53,43.65 78.02,34.14 U$44.MX2 78,23.64 85.05,16.6 112.37,16.6 120.33,8.63 127.27,8.63 129.61,6.29 132.96,6.29 137.19,10.52 IC2.38
COL4
  Bottom 0.152: U$6.MX2 92.29,79.29 96.76,74.81 99.34,74.81 100.86,73.29 100.86,73.18 U$26.MX2 101.81,58.05 105.62,54.25 105.62,54.13 U$40.MX2 106.58,43.65 97.11,34.18 | U$52.MX2 97.11,34.18 | IC2.39 137.56,11.32 132.84,6.6 129.73,6.6 127.39,8.94 120.45,8.94 112.49,16.9 103.25,16.9 97.11,23.04 97.11,34.18
COL5
  Bottom 0.152: U$7.MX2 111.34,79.26 115.78,74.81 118.39,74.81 119.91,73.29 119.91,73.18 U$16.MX2 120.86,58.05 124.67,54.25 124.67,54.13 U$32.MX2 125.63,43.65 116.2,34.22 U$45.MX2 116.09,13.73 120.58,9.24 127.52,9.24 129.86,6.9 132.71,6.9 137.93,12.12 IC2.40
COL6
  Bottom 0.152: U$9.MX2 130.39,79.2 134.77,74.82 137.43,74.82 138.96,73.29 138.96,73.18 U$18.MX2 139.91,58.05 143.72,54.25 143.72,54.13 U$33.MX2 144.68,43.65 U$46.MX2 135.15,17.56 136.56,16.15 136.56,16.03 U$58.MX2 139.67,12.92 IC2.41
COL7
  Bottom 0.152: U$61.MX2 281.92,16.6 281.92,71.34 275.07,78.19 275.07,92.75 273.34,94.48 152.64,94.48 U$10.MX2 149.44,79.32 153.95,74.81 156.49,74.81 158.01,73.29 158.01,73.18 U$27.MX2 158.96,58.05 162.77,54.25 162.77,54.13 U$41.MX2 163.73,43.65 U$53.MX2 154.2,30.76 149.39,25.95 143.81,20.37 143.81,17.77 147.86,13.72 IC2.42
COL8
  Bottom 0.152: U$24.MX2 280.38,72.45 274.77,78.06 274.77,92.63 273.22,94.18 171.39,94.18 U$11.MX2 168.49,79.22 172.9,74.81 175.54,74.81 177.06,73.29 177.06,73.18 U$20.MX2 178.01,58.05 181.82,54.25 181.82,54.13 U$34.MX2 182.78,43.65 U$47.MX2 173.25,18.17 176.12,15.3 176.12,8.77 172.58,5.23 165.29,5.23 162.28,8.25 162.28,8.43 161.77,8.94 161.22,8.94 IC2.20
COL9
  Bottom 0.152: U$19.MX2 272.31,92.24 272.31,92.35 270.79,93.87 190.13,93.87 U$13.MX2 187.54,79.39 192.12,74.81 194.59,74.81 196.11,73.29 196.11,73.18 U$21.MX2 197.06,58.05 200.87,54.25 200.87,54.13 U$35.MX2 201.83,43.65 U$48.MX2 192.3,21.98 188.9,18.58 179.75,18.58 176.42,15.25 176.42,8.64 172.7,4.92 165.15,4.92 161.96,8.12 IC2.21
COL10
  Bottom 0.152: U$14.MX2 206.59,79.28 211.03,74.84 213.61,74.84 215.16,73.29 215.16,73.18 U$28.MX2 216.11,58.05 219.92,54.25 219.92,54.13 U$42.MX2 220.88,43.65 U$54.MX2 211.35,17.47 U$62.MX2 207.99,16.03 207.99,16.15 206.48,17.67 204.33,17.67 204.33,17.66 180.13,17.66 177.36,14.89 177.36,8.28 170.43,1.35 160.69,1.35 157.05,5 IC2.26
COL11  (via drill 0.35)
  Top 0.152: v210.62,17.97 215.36,17.97 v215.37,17.99
  Bottom 0.152: U$15.MX2 225.64,79.23 230.05,74.81 232.69,74.81 234.21,73.29 234.21,73.18 U$22.MX2 235.16,58.05 238.97,54.25 238.97,54.13 U$36.MX2 239.93,43.65 U$49.MX2 230.4,18.87 229.52,17.99 | U$59.MX2 231.81,16.03 231.81,16.16 229.98,17.99 229.52,17.99 | v215.37,17.99 229.52,17.99 | v210.62,17.97 180.01,17.97 177.03,14.99 177.03,9.9 177.05,9.88 177.05,8.4 170.3,1.66 160.93,1.66 157.86,4.73 IC2.25
COL12  (via drill 0.35)
  Top 0.152: v209.94,18.58 209.96,18.59 230.94,18.59 v230.96,18.57
  Bottom 0.152: U$17.MX2 244.69,79.18 249.04,74.83 251.72,74.83 253.26,73.29 253.26,73.18 U$23.MX2 254.21,58.05 258.02,54.25 258.02,54.13 U$37.MX2 258.98,41.35 265.13,35.19 265.13,35.08 U$50.MX2 266.09,30.76 256.55,21.21 U$60.MX2 255.59,16.03 255.59,16.15 253.17,18.57 v230.96,18.57 | v209.94,18.58 209.64,18.28 179.88,18.28 176.72,15.12 176.72,8.51 172.83,4.62 165.02,4.62 162.32,7.32 IC2.22
D+  (via drill 0.35)
  Top 0.254: R4.2 164.99,96.87 165.4,96.46 245.38,96.46 246.9,94.94 246.9,81.3 256.33,71.87 256.33,60.3 261.2,55.42 261.2,40.75 260.12,39.67 250.41,39.67 230.91,20.17 165.18,20.17 160.12,15.11 154.32,15.11 v153.85,15.58
  Bottom 0.152: 153.82,17.1 IC2.4
  Bottom 0.254: 153.86,17.09 IC2.4 | v153.85,15.58 IC2.4
D-  (via drill 0.35)
  Top 0.254: R3.2 164.98,94.75 164.98,95.29 165.08,95.39 243.64,95.39 245.83,93.21 245.83,80.84 255.26,71.41 255.26,59.86 260.14,54.98 260.14,41.2 259.68,40.74 249.97,40.74 230.47,21.24 164.38,21.24 158.9,15.77 v155.11,15.77
  Bottom 0.152: IC2.3
  Bottom 0.254: v155.11,15.77 154.96,15.77 154.12,14.93 153.57,14.93 153.19,15.31 153.19,16.93 IC2.3
DN
  Top 0.254: IC1.4 152.54,95.39 153.26,95.39 153.93,94.72 R3.1 163.01,95.01
DP
  Top 0.254: 152.54,97.47 IC1.6 153.17,97.37 153.56,97.77 162.99,97.77 R4.1
GND  (via drill 0.35)
  Top 0.254: J1.B12 145.4,98.94 145.9,98.44 | J1.A1 145.9,98.44 | 145.9,98.44 v146.46,97.89 | J1.B1 138.9,97.53 v138.79,97.42 138.4,97.81 J1.A12
  Top 0.305: v152.21,15.79 152.21,14.38 v151.63,13.79
  Top 0.508: IC1.2 148.63,96.42 v148.61,96.44 | R6.2 270.86,103.75 S1.3 | v152.31,7.27 151.41,8.18 v151.37,8.18 | v143.2,19.38 v144.42,19.38 150.17,19.38 v151.11,18.43 151.2,18.35 154.51,18.35 v154.61,18.45 154.71,18.35 159.4,18.35 v161.06,20.01 | v159.37,11.73 v151.47,11.73 | v164.64,6.74 163.95,6.05 v162.15,6.05 161.15,5.05 v160.45,5.05
  Bottom 0.254: IC2.12 161.19,15.34 160.57,15.34 160,14.77 160,12.55
  Bottom 0.305: C6.2 | C2.2 151.21,5.67 151.54,5.67 | IC2.1 151.64,16.88 151.64,16.2 151.82,16.02 151.99,16.02 v152.21,15.79 | v151.63,13.79 150.86,13.79
  Bottom 0.508: IC2.18 Y1.2 | IC2.18 IC2.19 | IC2.18 160.25,10.52 160,10.77 160,11.72 | IC2.15 160.36,12.91 160,12.55 160,11.72 | 152.22,6.73 151.78,6.73 151.54,6.49 151.54,5.67 IC2.33 | 152.22,6.73 152.72,6.73 153.05,6.39 IC2.31 IC2.28 155.45,6.39 155.78,6.73 159.12,6.73 159.45,6.39 IC2.23 | IC2.23 159.48,5.55 | 150.86,8.45 150.53,8.13 IC2.35 | 150.86,8.45 150.86,11.73 | 150.86,11.73 150.86,13.79 150.86,14.19 150.52,14.53 IC2.43 | FB2.2 132.15,102.57 R2.2 134.89,101.32 R1.2 | S1.3 S1.2 | v148.61,96.44 147.91,96.44 v146.46,97.89 | 152.22,6.73 152.31,6.83 v152.31,7.27 | v151.37,8.18 151.13,8.18 150.86,8.45 | C1.2 144.42,18.75 v144.42,19.38 | C6.2 | IC2.1 151.11,17.41 v151.11,18.43 | IC2.5 154.65,18.41 v154.61,18.45 | 160,11.72 159.39,11.72 v159.37,11.73 | v151.47,11.73 150.86,11.73 | C3.2 161.79,19.27 v161.06,20.01 | C6.2 164.29,7.09 v164.64,6.74 | v160.45,5.05 159.98,5.05 IC2.23 | v162.15,6.05 163.44,4.76 C4.2
  Bottom 1.016: C5.2 146.26,19.19 C8.1 145.16,18.1 C1.2 | C7.1 166.27,12.97 Y1.4 | C6.2 163.43,9.2 Y1.2
  pour Bottom: 5.35,105.45 281.55,105.45 283.45,103.55 283.45,3.45 280.95,0.95 3.85,0.95 0.65,4.15 0.65,101.25 4.65,105.25
GNDSHIELD
  Bottom 0.305: 147.32,100.13 136.98,100.13
  Bottom 0.508: J1.S3 J1.S1 147.32,100.13 | FB2.1 136.73,103.61 J1.S4 J1.S2 136.98,100.13
N$1
  Bottom 0.152: U$1.MX1 2.64,77.85 D1.A
N$2
  Bottom 0.152: D2.A 20.66,88.74 U$2.MX1
N$3
  Bottom 0.152: D3.A 39.71,88.74 U$3.MX1
N$4
  Bottom 0.152: D4.A 58.76,88.74 U$5.MX1
N$5
  Bottom 0.152: D5.A 77.81,88.74 U$6.MX1
N$6
  Bottom 0.152: D6.A 96.86,88.74 U$7.MX1
N$7
  Bottom 0.152: D7.A 115.91,88.74 U$9.MX1
N$8
  Bottom 0.152: D8.A 134.96,88.74 U$10.MX1
N$9
  Bottom 0.152: D9.A 154.01,88.74 U$11.MX1
N$10
  Bottom 0.152: D10.A 173.06,88.74 U$13.MX1
N$11
  Bottom 0.152: D11.A 192.11,88.74 U$14.MX1
N$12
  Bottom 0.152: D12.A 211.16,88.74 U$15.MX1
N$13
  Bottom 0.152: D13.A 230.21,88.74 U$17.MX1
N$14
  Bottom 0.152: U$19.MX1 259.81,77.85 D14.A
N$15
  Bottom 0.152: D15.A 6.3,69.68 U$4.MX1
N$16
  Bottom 0.152: D16.A 30.12,69.68 U$25.MX1
N$17
  Bottom 0.152: D17.A 49.17,69.68 U$8.MX1
N$18
  Bottom 0.152: D18.A 68.22,69.68 U$12.MX1
N$19
  Bottom 0.152: D19.A 87.27,69.68 U$26.MX1
N$20
  Bottom 0.152: D20.A 106.32,69.68 U$16.MX1
N$21
  Bottom 0.152: D21.A 125.37,69.68 U$18.MX1
N$22
  Bottom 0.152: D22.A 144.42,69.68 U$27.MX1
N$23
  Bottom 0.152: D23.A 163.47,69.68 U$20.MX1
N$24
  Bottom 0.152: D24.A 182.52,69.68 U$21.MX1
N$25
  Bottom 0.152: D25.A 201.57,69.68 U$28.MX1
N$26
  Bottom 0.152: D26.A 220.62,69.68 U$22.MX1
N$27
  Bottom 0.152: U$23.MX1 239.67,69.68 D27.A
N$28
  Bottom 0.152: U$24.MX1 265.57,60.15 D28.A
N$29
  Bottom 0.152: D29.A 8.7,50.63 U$29.MX1
N$30
  Bottom 0.152: D30.A 34.89,50.63 U$39.MX1
N$31
  Bottom 0.152: D31.A 53.94,50.63 U$30.MX1
N$32
  Bottom 0.152: D32.A 73,50.63 U$31.MX1
N$33
  Bottom 0.152: D33.A 92.05,50.63 U$40.MX1
N$34
  Bottom 0.152: D34.A 111.09,50.63 U$32.MX1
N$35
  Bottom 0.152: D35.A 130.14,50.63 U$33.MX1
N$36
  Bottom 0.152: D36.A 149.19,50.63 U$41.MX1
N$37
  Bottom 0.152: D37.A 168.24,50.63 U$34.MX1
N$38
  Bottom 0.152: D38.A 187.29,50.63 U$35.MX1
N$39
  Bottom 0.152: 206.94,50.39 207.18,50.39 U$42.MX1 206.34,50.63 D39.A
N$40
  Bottom 0.152: D40.A 225.39,50.63 U$36.MX1
N$41
  Bottom 0.152: D41.A 244.44,50.63 U$37.MX1
N$42
  Bottom 0.152: D43.A 3.93,31.58 U$38.MX1
N$43
  Bottom 0.152: D44.A 25.37,31.58 U$51.MX1
N$44
  Bottom 0.152: D45.A 44.42,31.58 U$43.MX1
N$45
  Bottom 0.152: D46.A 63.47,31.58 U$44.MX1
N$46
  Bottom 0.152: D47.A 82.52,31.58 U$52.MX1
N$47
  Bottom 0.152: D48.A 101.57,31.58 U$45.MX1
N$48
  Bottom 0.152: D49.A 120.62,31.58 U$46.MX1
N$49
  Bottom 0.152: D50.A 139.67,31.58 U$53.MX1
N$50
  Bottom 0.152: D51.A 158.72,31.58 U$47.MX1
N$51
  Bottom 0.152: D52.A 177.77,31.58 U$48.MX1
N$52
  Bottom 0.152: D53.A 196.82,31.58 U$54.MX1
N$53
  Bottom 0.152: D54.A 215.87,31.58 U$49.MX1
N$54
  Bottom 0.152: U$50.MX1 252.64,20.69 D55.A
N$55
  Bottom 0.152: D57.A 3.97,12.54 U$55.MX1
N$56
  Bottom 0.152: D58.A 27.77,12.53 U$57.MX1
N$57
  Bottom 0.152: D59.A 51.59,12.54 U$56.MX1
N$58
  Bottom 0.152: D63.A 123.02,12.54 U$58.MX1
N$59
  Bottom 0.152: D67.A 194.45,12.53 U$62.MX1
N$60
  Bottom 0.152: D68.A 218.26,12.53 U$59.MX1
N$61
  Bottom 0.152: D69.A 242.07,12.53 U$60.MX1
N$62
  Bottom 0.152: D70.A 265.88,12.53 U$61.MX1
N$63
  Top 0.254: LED1.2 R6.1
N$70  (via drill 0.35)
  Top 0.254: J1.A5 143.9,99.02 v143.64,98.76
  Bottom 0.254: v143.64,98.76 142.71,99.69 140.07,99.69 139.17,98.78 136.06,98.78 135.44,98.78 | 135.44,98.78 135.37,98.78 | R1.1 135.44,98.78
N$71  (via drill 0.35)
  Top 0.254: J1.B5 140.9,98.79 140.86,98.76 v140.65,98.76
  Bottom 0.254: v140.65,98.76 139.72,98.76 139.33,98.37 133.1,98.37 R2.1
N$72
  Top 0.508: FUSE.2 FB1.1 | FB1.1
N$84
  Bottom 0.152: IC2.17 165.38,11.32 165.73,10.97 Y1.1 166.29,9.97 C6.1
N$85
  Bottom 0.152: IC2.16 163.12,12.12 Y1.3 164.27,13.27 C7.2
N$86
  Bottom 0.254: C8.2 147.71,20.65 153.64,20.65 155.45,18.84 IC2.6
N$88  (via drill 0.35)
  Top 0.254: 257.87,59.33 261.61,55.59 261.61,40.59 260.29,39.27 250.58,39.27 231.08,19.77 166.81,19.77 v162.81,15.77 | 257.87,59.33 | 257.87,59.33 256.73,60.47 256.73,72.05 247.3,81.48 247.3,95.26 250.21,98.16 271.36,98.16 S1.4 | S1.4 267.67,101.86 R5.1 | S1.4 S1.1
  Bottom 0.152: IC2.13 161.78,14.52
  Bottom 0.254: IC2.13 161.23,14.49 161.81,14.49 162.81,15.49 v162.81,15.77
ROW0
  Top 0.152: D1.C 16.22,76.68 D2.C D3.C D4.C D5.C D6.C D7.C D8.C D9.C D10.C D11.C D12.C D13.C
  Bottom 0.152: IC2.8 157.05,20.54 155.78,21.81 155.78,31.5 165.59,41.32 165.59,55.36 161.12,59.84 161.12,74.08 160.08,75.12 154.08,75.12 152.87,76.32 D9.C
ROW1
  Top 0.152: D15.C D16.C D17.C D18.C D19.C D20.C D21.C D22.C D23.C D24.C D25.C D26.C D27.C
  Bottom 0.152: D23.C 165.9,57.44 165.9,41.19 156.08,31.37 156.08,21.94 157.85,20.17 IC2.9
ROW2
  Top 0.152: D41.C D40.C D39.C D38.C D37.C D36.C D35.C D34.C D33.C D32.C D31.C D30.C D29.C
  Bottom 0.152: D37.C 167.05,41.91 156.39,31.25 156.39,22.06 158.65,19.8 IC2.10
ROW3
  Top 0.152: D43.C D44.C D45.C D46.C D47.C D48.C D49.C D50.C D51.C D52.C D53.C D54.C
  Bottom 0.152: D54.C 214.76,10.5 218.36,6.9 225.53,6.9 | 225.53,6.9 226.66,6.9 | D55.C 261.43,13.92 254.37,6.86 225.57,6.86 225.53,6.9 | D51.C 157.6,22.85 159.45,21.01 IC2.11
ROW4  (via drill 0.35)
  Top 0.152: D14.C 264.77,72.85 D28.C 267.46,65.88 267.46,6.5 D70.C D69.C D68.C D67.C 190.63,1.09 159.25,1.09 v156.26,4.08 153.27,1.09 153.02,1.09 124.62,1.09 D63.C D59.C D58.C D57.C
  Bottom 0.152: IC2.27 156.25,4.09 v156.26,4.08
USBDNEG  (via drill 0.35)
  Top 0.254: J1.B7 142.4,98.09 142.6,97.89 v142.63,97.89 | J1.A7 141.4,97.59 143.52,95.47 145.03,95.47 | 145.03,95.47 IC1.3 | v143.94,96.57 145.03,95.48 145.03,95.47
  Bottom 0.254: v142.63,97.89 v143.94,96.57
USBDPOS
  Top 0.254: J1.B6 141.9,97.67 142.34,97.23 144.16,97.23 | J1.A6 142.91,98.56 144.16,97.31 144.16,97.23 | 144.16,97.23 144.16,97.21 149.79,97.21 IC1.1
VBUS  (via drill 0.35)
  Top 0.254: J1.B4 139.9,98.14 v140,98.05 139.4,98.64 J1.A9 | J1.B9 144.4,99 v144.66,98.74 144.9,98.98 J1.A4
  Top 0.508: v151.2,96.42 IC1.5 FUSE.1
  Bottom 0.406: v144.66,98.74 144.66,98.64 148.34,94.97 | 148.35,94.95 148.34,94.97 | 148.34,94.97 149.64,94.97 | v140,98.05 143.08,94.97 148.34,94.97
  Bottom 0.508: 148.35,94.95 149.73,94.95 v151.2,96.42
VCC  (via drill 0.35)
  Top 0.254: 166.2,20.68 166.2,20.7 | 243.86,95.93 244.95,95.93 v245.08,95.8 | 253.2,101.98 254.97,103.74 LED1.1 | 253.2,101.98 247.06,95.83 v246.93,95.83 | R5.2 253.2,101.98
  Top 0.508: FB1.2 161.27,96.42 161.77,95.93 243.86,95.93 246.36,93.43 246.36,81.06 255.79,71.63 255.79,60.08 260.67,55.2 260.67,40.98 259.9,40.2 250.19,40.2 230.69,20.7 166.2,20.7 164.77,20.7 164.77,20.69 v161.78,17.7
  Bottom 0.254: 149.57,19.35 C5.1 149.02,19.26 149.02,17.84 149.7,17.16 149.7,16.73 | C3.1 163.31,17.76 163.31,17.19 | 149.59,16.63 147.13,16.63 146.83,16.33 | IC2.24 158.65,4.44 159.75,3.34 C4.1 162.02,4.73 157.74,9.01 157.74,13.63 | IC2.34 148.47,7.32 147.48,6.34 C2.1 148.88,4.76 157.74,13.63 | v245.08,95.8 246.9,95.8 v246.93,95.83 | IC2.7 156.26,15.98 154.55,14.28 152.8,14.28 150.36,16.72 150.36,19.06 150.07,19.35 151.13,19.35 152.25,18.23 IC2.2 | IC2.44 149.05,15.32 148.53,14.8 147.58,14.8 146.83,15.55 146.83,16.33 | C1.1 146.83,16.33 | C3.1 163.41,17.29 162.14,16.02 161.53,16.02 161.14,16.41 161.14,17.03 161.28,17.17 | C3.1 164.75,17.86 165.14,17.47 165.14,16.78 164.57,16.2 164.18,16.2 162.23,14.25 162.23,14.11 161.84,13.72 IC2.14 | 157.74,13.63 157.75,13.64
  Bottom 0.305: 149.7,16.73 149.7,16.69 149.76,16.63 | 149.59,16.63 149.76,16.63 | 149.76,16.63 152.75,13.64 157.75,13.64 157.83,13.72 | C5.1 150.07,19.35
  Bottom 0.508: v161.78,17.7 161.78,17.67 161.28,17.17 157.83,13.72